# Altium schematic sheet FMC_HPC_UFL_DEBUG_HPC_JK.SchDoc: HPC connector ROW J and ROW K
size A4; Date: 13.12.2024; ApprovedBy: PFH; CompanyName: IAM Electronic GmbH; DrawnBy: PFH; Engineer: PFH; DocumentNumber: 9; Revision: A; SheetNumber: 9; SheetTotal: 9; Projekt: FMC HPC-U.FL Debug Board; Website: www.fmchub.com
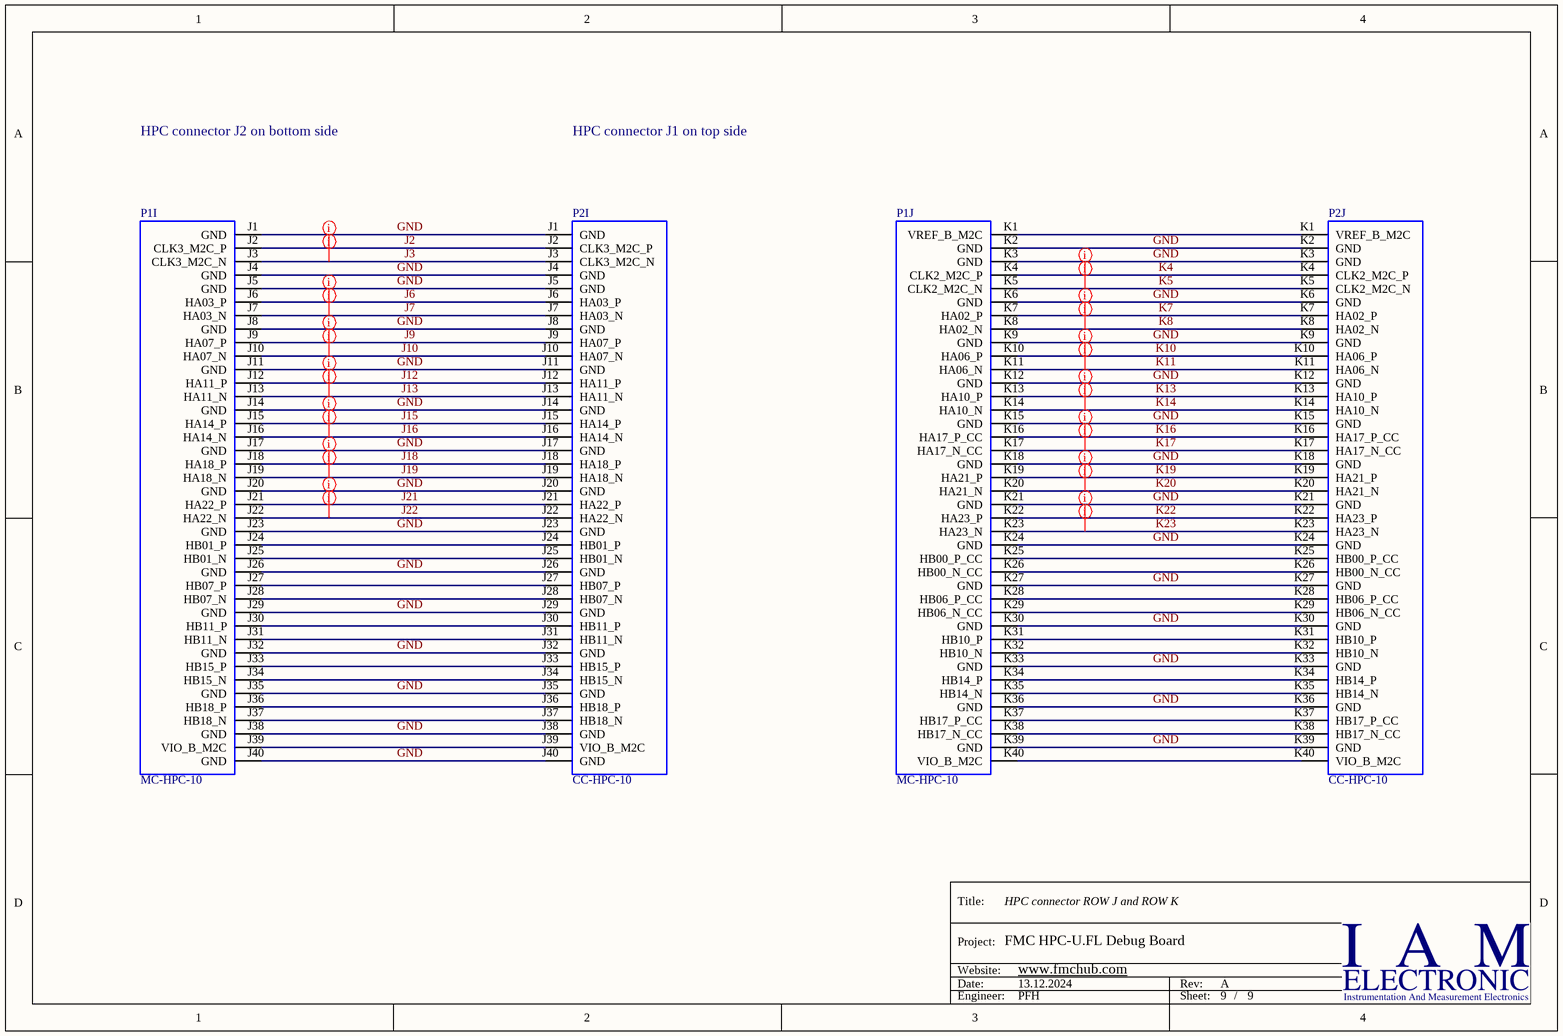
[diagram p0: FMC_HPC_UFL_DEBUG_HPC_JK.SchDoc]

## Parts
P1  MC-HPC-10  [ASP-134488-01]  (parts I,J of 10)
P2  CC-HPC-10  [ASP-134486-01]  (parts I,J of 10)

## Nets
GND: P1.J1(GND) P1.J4(GND) P1.J5(GND) P1.J8(GND) P1.J11(GND) P1.J14(GND) P1.J17(GND) P1.J20(GND) P1.J23(GND) P1.J26(GND) P1.J29(GND) P1.J32(GND) P1.J35(GND) P1.J38(GND) P1.J40(GND) P1.K2(GND) P1.K3(GND) P1.K6(GND) P1.K9(GND) P1.K12(GND) P1.K15(GND) P1.K18(GND) P1.K21(GND) P1.K24(GND) P1.K27(GND) P1.K30(GND) P1.K33(GND) P1.K36(GND) P1.K39(GND) P2.J1(GND) P2.J4(GND) P2.J5(GND) P2.J8(GND) P2.J11(GND) P2.J14(GND) P2.J17(GND) P2.J20(GND) P2.J23(GND) P2.J26(GND) P2.J29(GND) P2.J32(GND) P2.J35(GND) P2.J38(GND) P2.J40(GND) P2.K2(GND) P2.K3(GND) P2.K6(GND) P2.K9(GND) P2.K12(GND) P2.K15(GND) P2.K18(GND) P2.K21(GND) P2.K24(GND) P2.K27(GND) P2.K30(GND) P2.K33(GND) P2.K36(GND) P2.K39(GND)
J2: P1.J2(CLK3_M2C_P) P2.J2(CLK3_M2C_P)
J3: P1.J3(CLK3_M2C_N) P2.J3(CLK3_M2C_N)
J6: P1.J6(HA03_P) P2.J6(HA03_P)
J7: P1.J7(HA03_N) P2.J7(HA03_N)
J9: P1.J9(HA07_P) P2.J9(HA07_P)
J10: P1.J10(HA07_N) P2.J10(HA07_N)
J12: P1.J12(HA11_P) P2.J12(HA11_P)
J13: P1.J13(HA11_N) P2.J13(HA11_N)
J15: P1.J15(HA14_P) P2.J15(HA14_P)
J16: P1.J16(HA14_N) P2.J16(HA14_N)
J18: P1.J18(HA18_P) P2.J18(HA18_P)
J19: P1.J19(HA18_N) P2.J19(HA18_N)
J21: P1.J21(HA22_P) P2.J21(HA22_P)
J22: P1.J22(HA22_N) P2.J22(HA22_N)
K4: P1.K4(CLK2_M2C_P) P2.K4(CLK2_M2C_P)
K5: P1.K5(CLK2_M2C_N) P2.K5(CLK2_M2C_N)
K7: P1.K7(HA02_P) P2.K7(HA02_P)
K8: P1.K8(HA02_N) P2.K8(HA02_N)
K10: P1.K10(HA06_P) P2.K10(HA06_P)
K11: P1.K11(HA06_N) P2.K11(HA06_N)
K13: P1.K13(HA10_P) P2.K13(HA10_P)
K14: P1.K14(HA10_N) P2.K14(HA10_N)
K16: P1.K16(HA17_P_CC) P2.K16(HA17_P_CC)
K17: P1.K17(HA17_N_CC) P2.K17(HA17_N_CC)
K19: P1.K19(HA21_P) P2.K19(HA21_P)
K20: P1.K20(HA21_N) P2.K20(HA21_N)
K22: P1.K22(HA23_P) P2.K22(HA23_P)
K23: P1.K23(HA23_N) P2.K23(HA23_N)
NetP1_J24: P1.J24(HB01_P) P2.J24(HB01_P)
NetP1_J25: P1.J25(HB01_N) P2.J25(HB01_N)
NetP1_J27: P1.J27(HB07_P) P2.J27(HB07_P)
NetP1_J28: P1.J28(HB07_N) P2.J28(HB07_N)
NetP1_J30: P1.J30(HB11_P) P2.J30(HB11_P)
NetP1_J31: P1.J31(HB11_N) P2.J31(HB11_N)
NetP1_J33: P1.J33(HB15_P) P2.J33(HB15_P)
NetP1_J34: P1.J34(HB15_N) P2.J34(HB15_N)
NetP1_J36: P1.J36(HB18_P) P2.J36(HB18_P)
NetP1_J37: P1.J37(HB18_N) P2.J37(HB18_N)
NetP1_J39: P1.J39(VIO_B_M2C) P2.J39(VIO_B_M2C)
NetP1_K1: P1.K1(VREF_B_M2C) P2.K1(VREF_B_M2C)
NetP1_K25: P1.K25(HB00_P_CC) P2.K25(HB00_P_CC)
NetP1_K26: P1.K26(HB00_N_CC) P2.K26(HB00_N_CC)
NetP1_K28: P1.K28(HB06_P_CC) P2.K28(HB06_P_CC)
NetP1_K29: P1.K29(HB06_N_CC) P2.K29(HB06_N_CC)
NetP1_K31: P1.K31(HB10_P) P2.K31(HB10_P)
NetP1_K32: P1.K32(HB10_N) P2.K32(HB10_N)
NetP1_K34: P1.K34(HB14_P) P2.K34(HB14_P)
NetP1_K35: P1.K35(HB14_N) P2.K35(HB14_N)
NetP1_K37: P1.K37(HB17_P_CC) P2.K37(HB17_P_CC)
NetP1_K38: P1.K38(HB17_N_CC) P2.K38(HB17_N_CC)
NetP1_K40: P1.K40(VIO_B_M2C) P2.K40(VIO_B_M2C)

## Layout directives
rule Width Constraint [Pref Impedance = 50,00ohms    Min Impedance = 50,00ohms    Max Impedance = 50,00ohms]; net class FMC_CLK: J2, J3, K4, K5
rule Width Constraint [Pref Impedance = 50,00ohms    Min Impedance = 50,00ohms    Max Impedance = 50,00ohms]; net class FMC_HA: J6, J7, J9, J10, J12, J13, J15, J16, J18, J19, J21, J22, K7, K8, K10, K11, K13, K14, K16, K17, K19, K20, K22, K23

## Notes on the sheet
- HPC connector J2 on bottom side
- HPC connector J1 on top side
- Title:
- Project:
- Date:
- Website:
- Rev:
- Engineer:
- Sheet:
- /

## Library data of the parts
P1 = MC-HPC-10: MC-HPC-10, FMC High-pin count connector, lead free, 400 I/Os, male, 10 mm mated stack height; Manufacturer: Samtec; Manufacturer Ref: SEAM-40-03.5-S-10-2-A-K-TR-VITA57.0; Pitch: 1.27 mm; Mated Stack Height: 10 mm; Solder Type: Lead-Free; Number I/O: 400; PartName: ASP-134488-01; Part: ASP-134488-01; Vita PartNumber: MC-HPC-10; Pin Count: High; Gender: male; Supplier 1: Digi-Key; Supplier Part Number 1: SAM8730-ND
P2 = CC-HPC-10: CC-HPC-10, FMC High-pin count connector, lead free, 400 I/Os, female, 10 mm mated stack height; Manufacturer: Samtec; Manufacturer Ref: SEAF-40-06.5-10-A; Pitch: 1.27 mm; Mated Stack Height: 10 mm; Solder Type: Lead-Free; Number I/O: 400; PartName: ASP-134486-01; Part: ASP-134486-01; Vita PartNumber: CC-HPC-10; Pin Count: High; Gender: female; Supplier 1: Digi-Key; Supplier Part Number 1: SAM8728-ND